# Altium schematic sheet custom_line_V1_mux5.SchDoc
size 209 x 297 mm
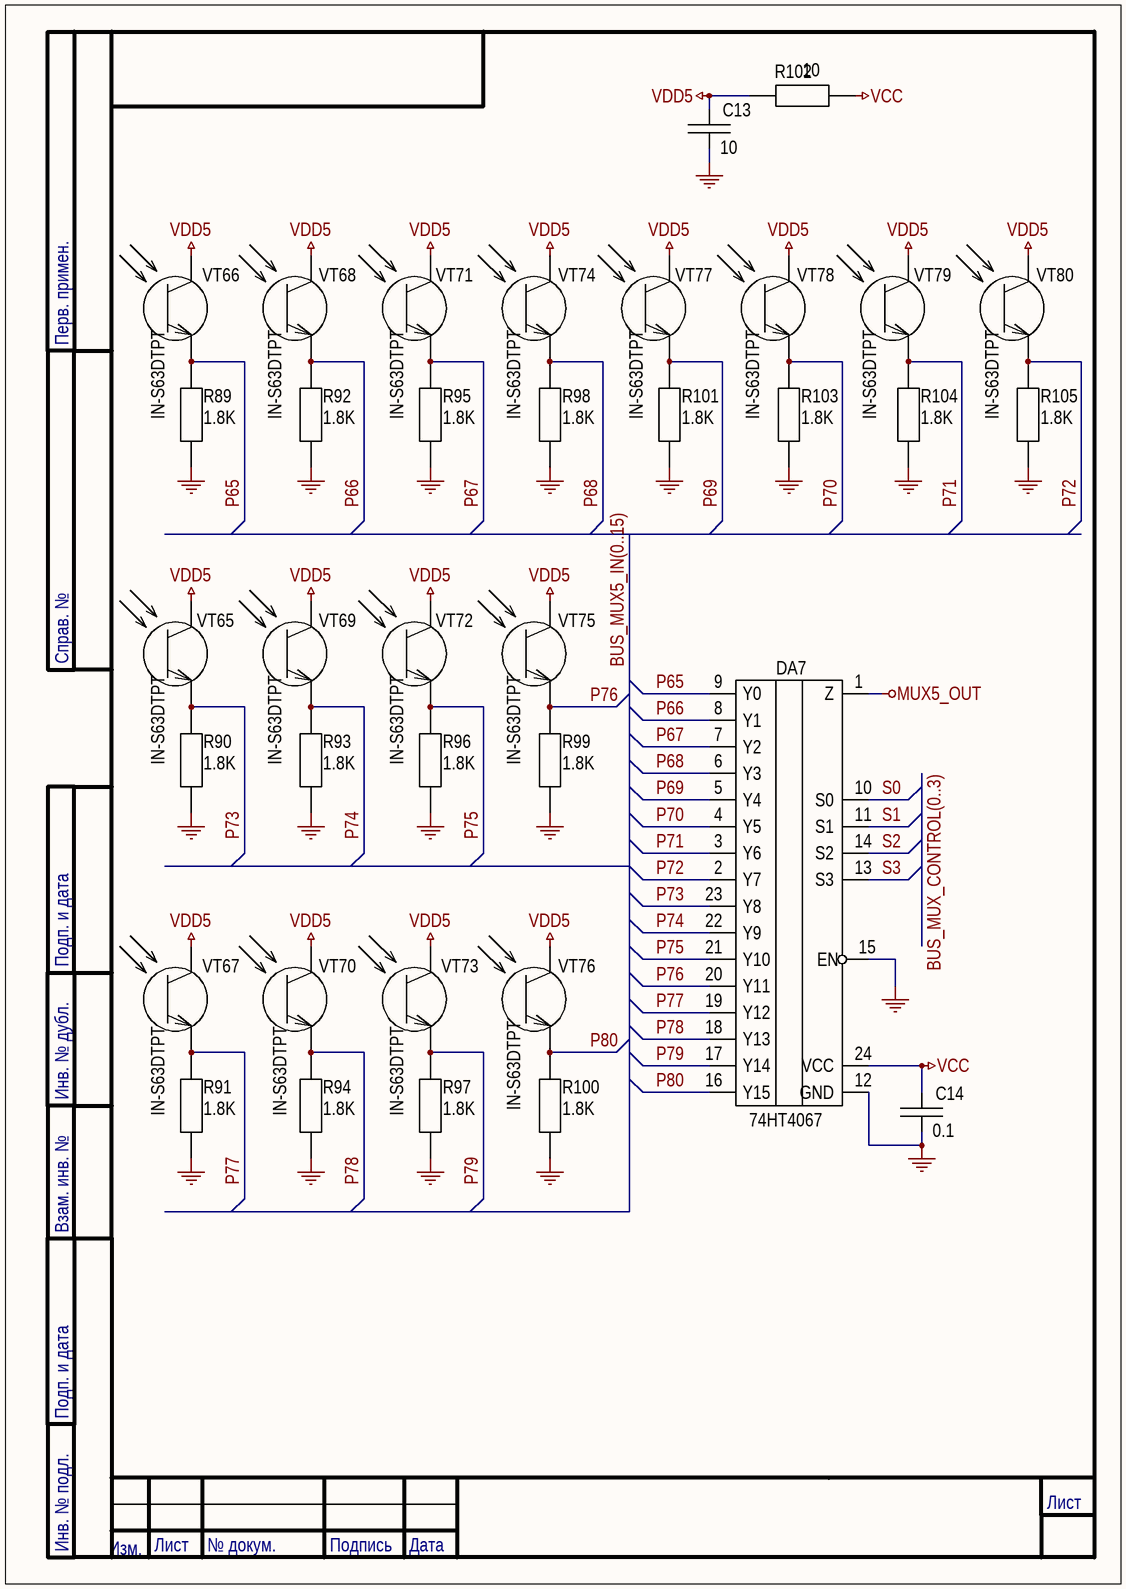
[diagram p0: custom_line_V1_mux5.SchDoc]

## Parts
C13  10  [CC_0805]
C14  0.1  [CC_0603]
DA7  type: 74HT4067  [TSSOP-24]  (hidden comment: 74HC4067)
R89  1.8K  [RC_0603_SMALL]
R90  1.8K  [RC_0603_SMALL]
R91  1.8K  [RC_0603_SMALL]
R92  1.8K  [RC_0603_SMALL]
R93  1.8K  [RC_0603_SMALL]
R94  1.8K  [RC_0603_SMALL]
R95  1.8K  [RC_0603_SMALL]
R96  1.8K  [RC_0603_SMALL]
R97  1.8K  [RC_0603_SMALL]
R98  1.8K  [RC_0603_SMALL]
R99  1.8K  [RC_0603_SMALL]
R100  1.8K  [RC_0603_SMALL]
R101  1.8K  [RC_0603_SMALL]
R102  10  [RC_0603_SMALL]
R103  1.8K  [RC_0603_SMALL]
R104  1.8K  [RC_0603_SMALL]
R105  1.8K  [RC_0603_SMALL]
VT65  IN-S63DTPT  [LED_0603]
VT66  IN-S63DTPT  [LED_0603]
VT67  IN-S63DTPT  [LED_0603]
VT68  IN-S63DTPT  [LED_0603]
VT69  IN-S63DTPT  [LED_0603]
VT70  IN-S63DTPT  [LED_0603]
VT71  IN-S63DTPT  [LED_0603]
VT72  IN-S63DTPT  [LED_0603]
VT73  IN-S63DTPT  [LED_0603]
VT74  IN-S63DTPT  [LED_0603]
VT75  IN-S63DTPT  [LED_0603]
VT76  IN-S63DTPT  [LED_0603]
VT77  IN-S63DTPT  [LED_0603]
VT78  IN-S63DTPT  [LED_0603]
VT79  IN-S63DTPT  [LED_0603]
VT80  IN-S63DTPT  [LED_0603]

## Nets
GND: C13.1 C14.1 DA7.12(GND) DA7.15(EN) R89.1 R90.1 R91.1 R92.1 R93.1 R94.1 R95.1 R96.1 R97.1 R98.1 R99.1 R100.1 R101.1 R103.1 R104.1 R105.1
MUX5_OUT: DA7.1(Z)
VCC: C14.2 DA7.24(VCC) R102.1
VDD5: C13.2 R102.2 VT65.1(C) VT66.1(C) VT67.1(C) VT68.1(C) VT69.1(C) VT70.1(C) VT71.1(C) VT72.1(C) VT73.1(C) VT74.1(C) VT75.1(C) VT76.1(C) VT77.1(C) VT78.1(C) VT79.1(C) VT80.1(C)
P65: DA7.9(Y0) R89.2 VT66.2(E)
P66: DA7.8(Y1) R92.2 VT68.2(E)
P67: DA7.7(Y2) R95.2 VT71.2(E)
P68: DA7.6(Y3) R98.2 VT74.2(E)
P69: DA7.5(Y4) R101.2 VT77.2(E)
P70: DA7.4(Y5) R103.2 VT78.2(E)
P71: DA7.3(Y6) R104.2 VT79.2(E)
P72: DA7.2(Y7) R105.2 VT80.2(E)
P73: DA7.23(Y8) R90.2 VT65.2(E)
P74: DA7.22(Y9) R93.2 VT69.2(E)
P75: DA7.21(Y10) R96.2 VT72.2(E)
P76: DA7.20(Y11) R99.2 VT75.2(E)
P77: DA7.19(Y12) R91.2 VT67.2(E)
P78: DA7.18(Y13) R94.2 VT70.2(E)
P79: DA7.17(Y14) R97.2 VT73.2(E)
P80: DA7.16(Y15) R100.2 VT76.2(E)
S0: DA7.10(S0)
S1: DA7.11(S1)
S2: DA7.14(S2)
S3: DA7.13(S3)

## Buses and harness runs
bus BUS_MUX5_IN(0..15)
bus BUS_MUX_CONTROL(0..3)

## Notes on the sheet
- Перв. примен.
- Справ. №
- Подп. и дата
- Инв. № дубл.
- Взам. инв. №
- Изм.
- Лист
- Инв. № подл.
- № докум.
- Подпись
- Дата

## Library data of the parts
C13 = C: type: CC-0805-106-16V-X7R-10%; value: 10uF
C14 = C: type: CC-0603-B-104-K-50; value: 0.1uF
DA7 = 74HCT4067: 74HC4067PW
R89-R101 R103-R105 = R: power: 0.125W; value: 100K; type: RC-0603-104-5%
R102 = R: power: 0.125W; type: RC-0603-R10-5%; value: 10
VT65-VT80 = phototransistor: Phototransistor (Inolux); type: IN-S63DTPT